# EAGLE schematic lsm_2x_daisy (EAGLE 7.4.0)
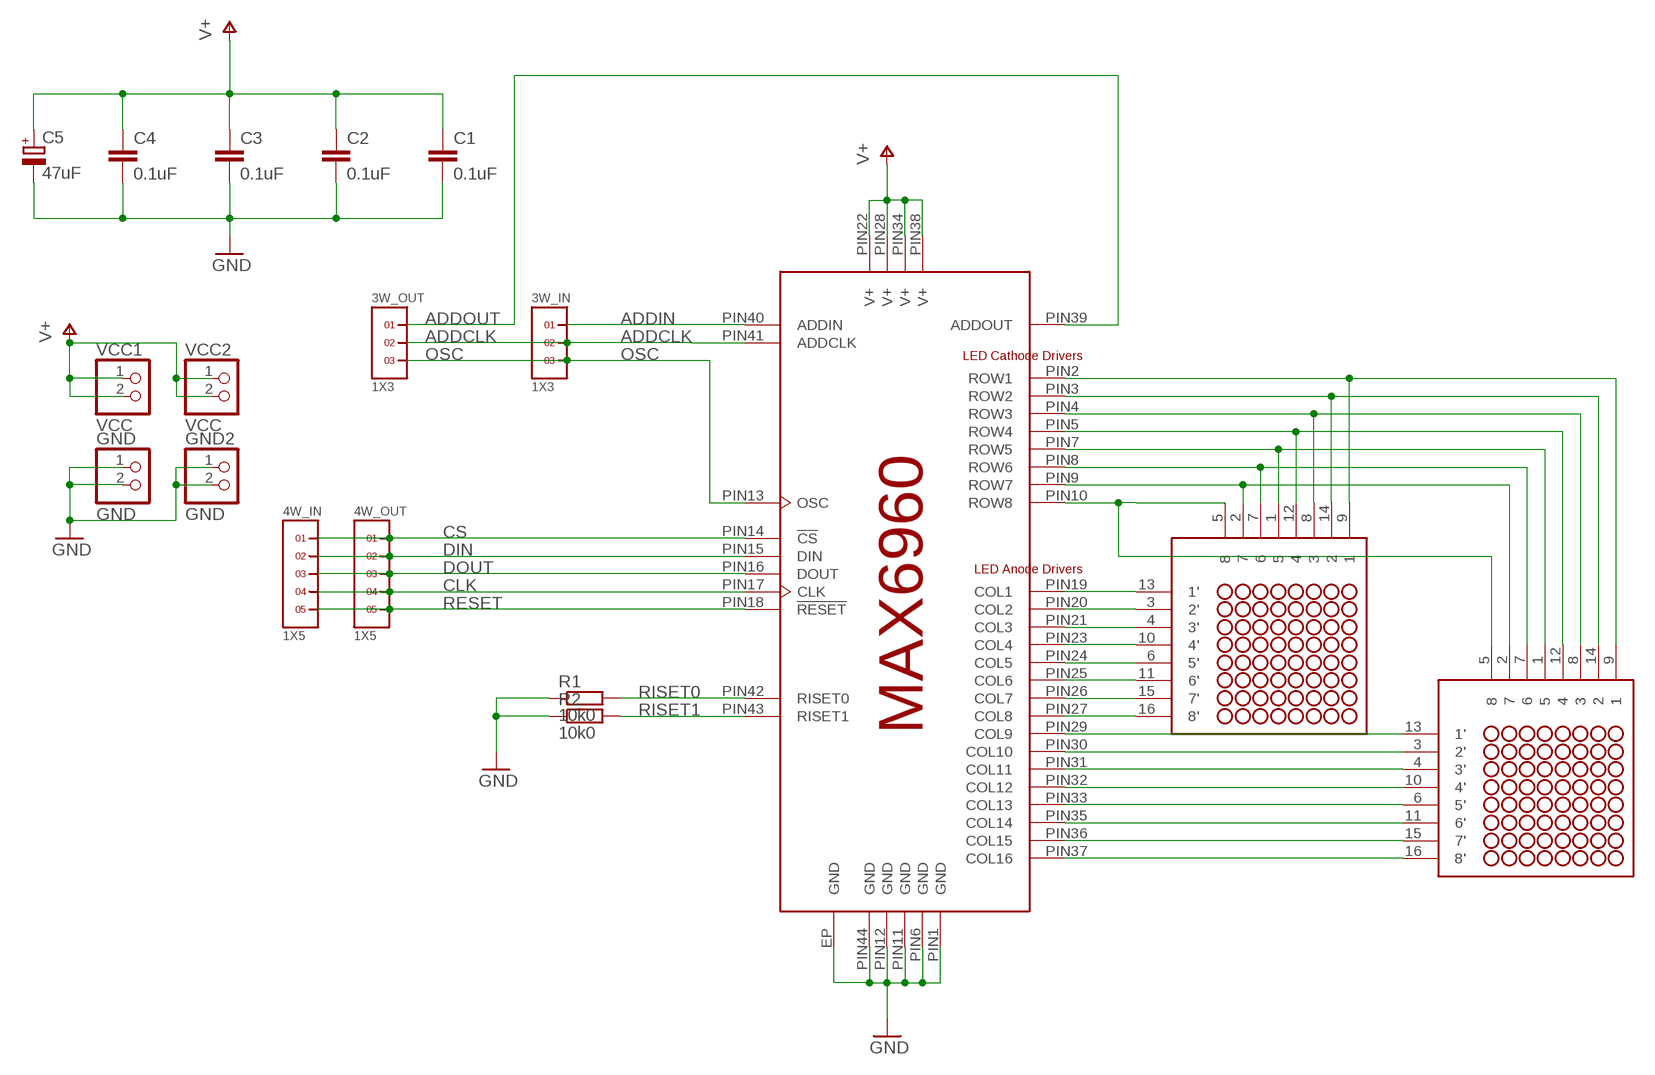
[diagram p0: schematic, sheet 1]

## Parts
3W_IN  1X3  [1X3]
3W_OUT  1X3  [1X3]
4W_IN  1X5  [1X5]
4W_OUT  1X5  [1X5]
C1  0.1uF  C-EUC0805  [C0805]
C2  0.1uF  C-EUC0805  [C0805]
C3  0.1uF  C-EUC0805  [C0805]
C4  0.1uF  C-EUC0805  [C0805]
C5  47uF  CPOL-EUE2-5  [E2-5]
GND  GND  PINHD-1X2  [1X02]
GND2  GND  PINHD-1X2  [1X02]
M1  NFM-12881BG-11LILPADS  [NFM-12881BG-11-SMALL-LILPADS]
M2  NFM-12881BG-11LILPADS  [NFM-12881BG-11-SMALL-LILPADS]
MAX6960  MAX6960  [44TQFN-EP]
R1  10k0  R-EU_R0805  [R0805]
R2  10k0  R-EU_R0805  [R0805]
VCC1  VCC  PINHD-1X2  [1X02]
VCC2  VCC  PINHD-1X2  [1X02]

## Nets
ADDCLK: 3W_IN.2 3W_OUT.2 MAX6960.PIN41(ADDCLK)
ADDIN: 3W_IN.1 MAX6960.PIN40(ADDIN)
ADDOUT: 3W_OUT.1 MAX6960.PIN39(ADDOUT)
CLK: 4W_IN.4 4W_OUT.4 MAX6960.PIN17(CLK)
CS: 4W_IN.1 4W_OUT.1 MAX6960.PIN14(!CS)
DIN: 4W_IN.2 4W_OUT.2 MAX6960.PIN15(DIN)
DOUT: 4W_IN.3 4W_OUT.3 MAX6960.PIN16(DOUT)
GND [GND]: C1.2 C2.2 C3.2 C4.2 C5.- GND2.1 GND2.2 GND.1 GND.2 MAX6960.EP(GND) MAX6960.PIN1(GND) MAX6960.PIN6(GND) MAX6960.PIN11(GND) MAX6960.PIN12(GND) MAX6960.PIN44(GND) R1.1 R2.1
N$1: M1.13(1') MAX6960.PIN19(COL1)
N$3: M1.3(2') MAX6960.PIN20(COL2)
N$4: M1.10(4') MAX6960.PIN23(COL4)
N$5: M1.6(5') MAX6960.PIN24(COL5)
N$6: M1.11(6') MAX6960.PIN25(COL6)
N$7: M1.15(7') MAX6960.PIN26(COL7)
N$8: M1.16(8') MAX6960.PIN27(COL8)
N$9: M2.13(1') MAX6960.PIN29(COL9)
N$10: M2.3(2') MAX6960.PIN30(COL10)
N$12: M2.4(3') MAX6960.PIN31(COL11)
N$13: M2.10(4') MAX6960.PIN32(COL12)
N$14: M2.6(5') MAX6960.PIN33(COL13)
N$15: M2.11(6') MAX6960.PIN35(COL14)
N$16: M2.15(7') MAX6960.PIN36(COL15)
N$17: M2.16(8') MAX6960.PIN37(COL16)
N$18: M1.9 M2.9 MAX6960.PIN2(ROW1)
N$19: M1.14 M2.14 MAX6960.PIN3(ROW2)
N$20: M1.8 M2.8 MAX6960.PIN4(ROW3)
N$21: M1.12 M2.12 MAX6960.PIN5(ROW4)
N$22: M1.1 M2.1 MAX6960.PIN7(ROW5)
N$23: M1.7 M2.7 MAX6960.PIN8(ROW6)
N$24: M1.2 M2.2 MAX6960.PIN9(ROW7)
N$26: M1.4(3') MAX6960.PIN21(COL3)
N$27: M1.5 M2.5 MAX6960.PIN10(ROW8)
OSC: 3W_IN.3 3W_OUT.3 MAX6960.PIN13(OSC)
RESET: 4W_IN.5 4W_OUT.5 MAX6960.PIN18(!RESET)
RISET0: MAX6960.PIN42(RISET0) R1.2
RISET1: MAX6960.PIN43(RISET1) R2.2
V+ [power]: C1.1 C2.1 C3.1 C4.1 C5.+ MAX6960.PIN22(V+) MAX6960.PIN28(V+) MAX6960.PIN34(V+) MAX6960.PIN38(V+) VCC1.1 VCC1.2 VCC2.1 VCC2.2

## Library data of the parts
3W_IN 3W_OUT = pinheaders_2mm:1X3
4W_IN 4W_OUT = pinheaders_2mm:1X5
C1-C4 = rcl:C-EU: CAPACITOR, European symbol
C5 = rcl:CPOL-EU: POLARIZED CAPACITOR, European symbol
GND GND2 VCC1 VCC2 = pinhead:PINHD-1X2: PIN HEADER
M1 M2 = eagle-library-edeca.net-v5:NFM-12881BG-11: Futurlec 8x8 LED Matrix
MAX6960 = led-stuff:MAX6960: MAX6960 8x8 LED Contriller - Thin QFN no leads
R1 R2 = rcl:R-EU_: RESISTOR, European symbol

## Net classes
0 default: width 0.152 mm, clearance 0.152 mm
1 power: width 0.203 mm, clearance 0.178 mm
2 GND: width 0.203 mm, clearance 0.178 mm
3 power+: width 0.406 mm, clearance 0.203 mm